# EAGLE design LED_DRIVER (EAGLE 9.6.2)
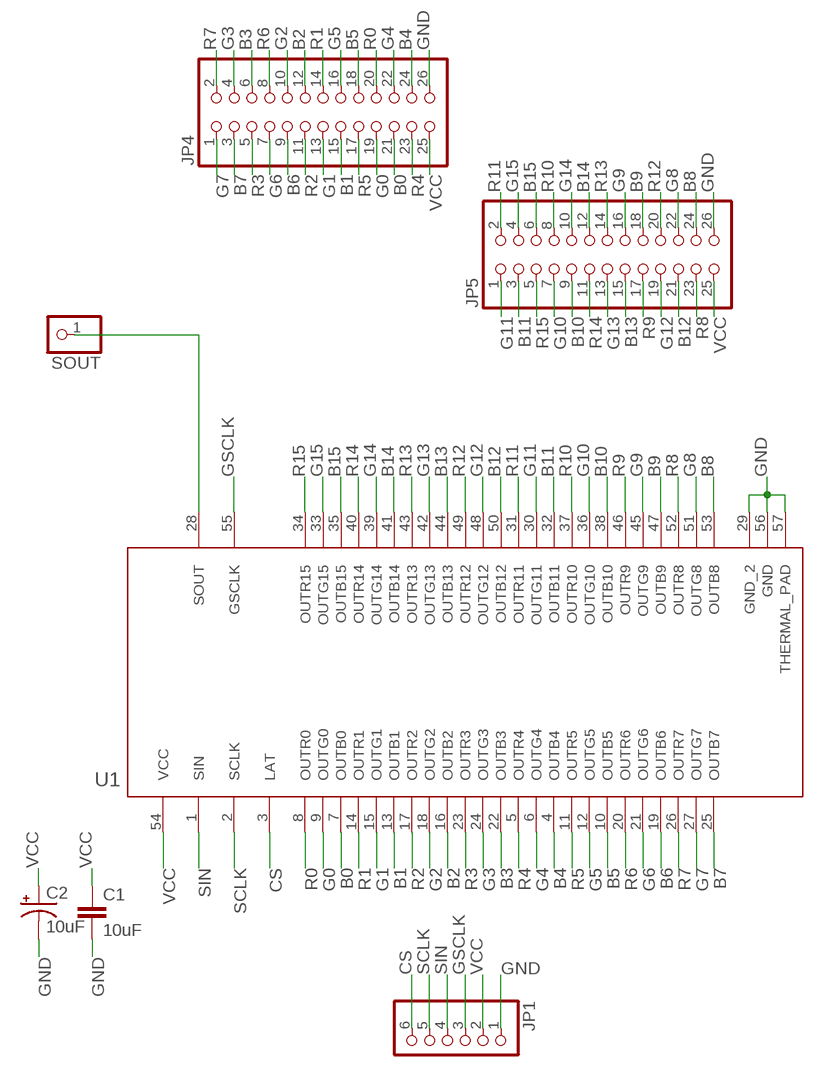
[diagram p0: schematic, sheet 1]

## Parts
C1  10uF  C-EUC0603  [C0603]
C2  10uF  CPOL-USE2-4  [E2-4]
JP1  PINHD-1X6  [1X06]
JP4  PINHD-2X13  [2X13]
JP5  PINHD-2X13  [2X13]
SOUT  PINHD-1X1  [1X01]
U1  Value  TLC6C5748QDCARQ1DCA0056F-IPC_B  [DCA0056F-IPC_B]

## Nets
B0: JP4.21 U1.7(OUTB0)
B1: JP4.15 U1.13(OUTB1)
B2: JP4.12 U1.16(OUTB2)
B3: JP4.6 U1.22(OUTB3)
B4: JP4.24 U1.4(OUTB4)
B5: JP4.18 U1.10(OUTB5)
B6: JP4.9 U1.19(OUTB6)
B7: JP4.3 U1.25(OUTB7)
B8: JP5.24 U1.53(OUTB8)
B9: JP5.18 U1.47(OUTB9)
B10: JP5.9 U1.38(OUTB10)
B11: JP5.3 U1.32(OUTB11)
B12: JP5.21 U1.50(OUTB12)
B13: JP5.15 U1.44(OUTB13)
B14: JP5.12 U1.41(OUTB14)
B15: JP5.6 U1.35(OUTB15)
CS: JP1.6 U1.3(LAT)
G0: JP4.19 U1.9(OUTG0)
G1: JP4.13 U1.15(OUTG1)
G2: JP4.10 U1.18(OUTG2)
G3: JP4.4 U1.24(OUTG3)
G4: JP4.22 U1.6(OUTG4)
G5: JP4.16 U1.12(OUTG5)
G6: JP4.7 U1.21(OUTG6)
G7: JP4.1 U1.27(OUTG7)
G8: JP5.22 U1.51(OUTG8)
G9: JP5.16 U1.45(OUTG9)
G10: JP5.7 U1.36(OUTG10)
G11: JP5.1 U1.30(OUTG11)
G12: JP5.19 U1.48(OUTG12)
G13: JP5.13 U1.42(OUTG13)
G14: JP5.10 U1.39(OUTG14)
G15: JP5.4 U1.33(OUTG15)
GND: C1.2 C2.- JP1.1 JP4.26 JP5.26 U1.29(GND_2) U1.56(GND) U1.57(THERMAL_PAD)
GSCLK: JP1.3 U1.55(GSCLK)
R0: JP4.20 U1.8(OUTR0)
R1: JP4.14 U1.14(OUTR1)
R2: JP4.11 U1.17(OUTR2)
R3: JP4.5 U1.23(OUTR3)
R4: JP4.23 U1.5(OUTR4)
R5: JP4.17 U1.11(OUTR5)
R6: JP4.8 U1.20(OUTR6)
R7: JP4.2 U1.26(OUTR7)
R8: JP5.23 U1.52(OUTR8)
R9: JP5.17 U1.46(OUTR9)
R10: JP5.8 U1.37(OUTR10)
R11: JP5.2 U1.31(OUTR11)
R12: JP5.20 U1.49(OUTR12)
R13: JP5.14 U1.43(OUTR13)
R14: JP5.11 U1.40(OUTR14)
R15: JP5.5 U1.34(OUTR15)
SCLK: JP1.5 U1.2(SCLK)
SIN: JP1.4 U1.1(SIN)
SOUT: SOUT.1 U1.28(SOUT)
VCC: C1.1 C2.+ JP1.2 JP4.25 JP5.25 U1.54(VCC)

## Library data of the parts
C1 = rcl:C-EU: CAPACITOR, European symbol; SPICEPREFIX: C
C2 = rcl:CPOL-US: POLARIZED CAPACITOR, American symbol; SPICEPREFIX: C
JP1 = pinhead:PINHD-1X6: PIN HEADER
JP4 JP5 = pinhead:PINHD-2X13: PIN HEADER
SOUT = adafruit:PINHD-1X1: Pin header 1x1 for 0.1" spacing With round pins
U1 = 48chLEDDriver:TLC6C5748QDCARQ1; MANUFACTURER: Texas Instruments; PARTNUMBER: TLC6C5748QDCARQ1; REFDES: RefDes; TYPE: TYPE

## Board
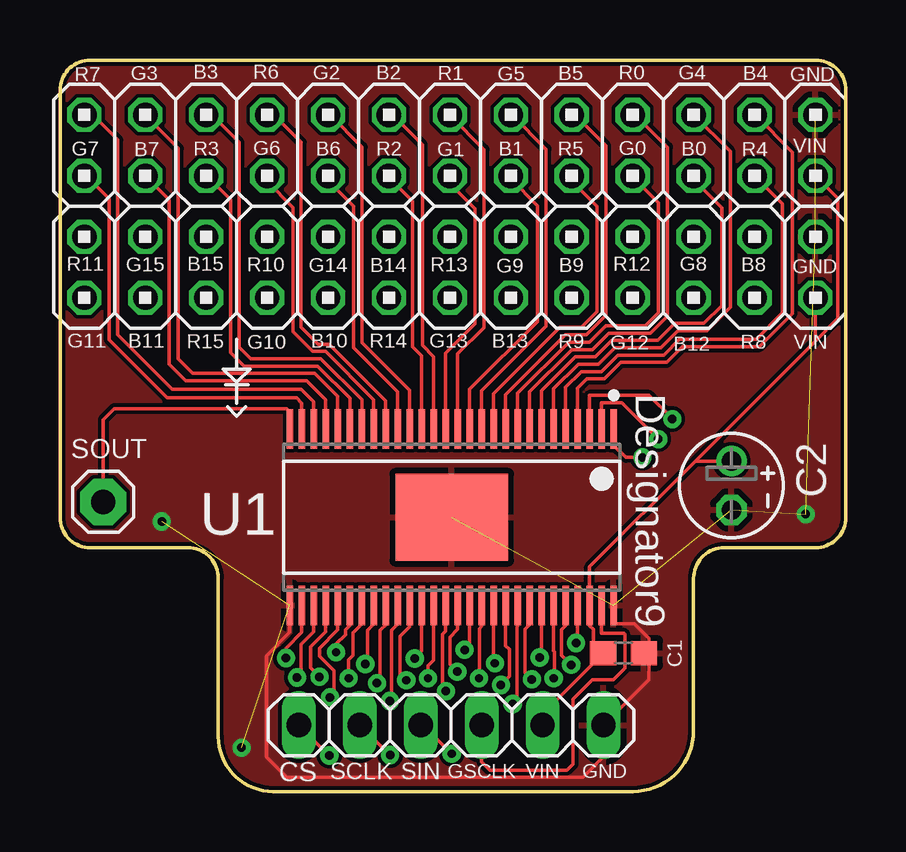
[diagram p1: board, top side]
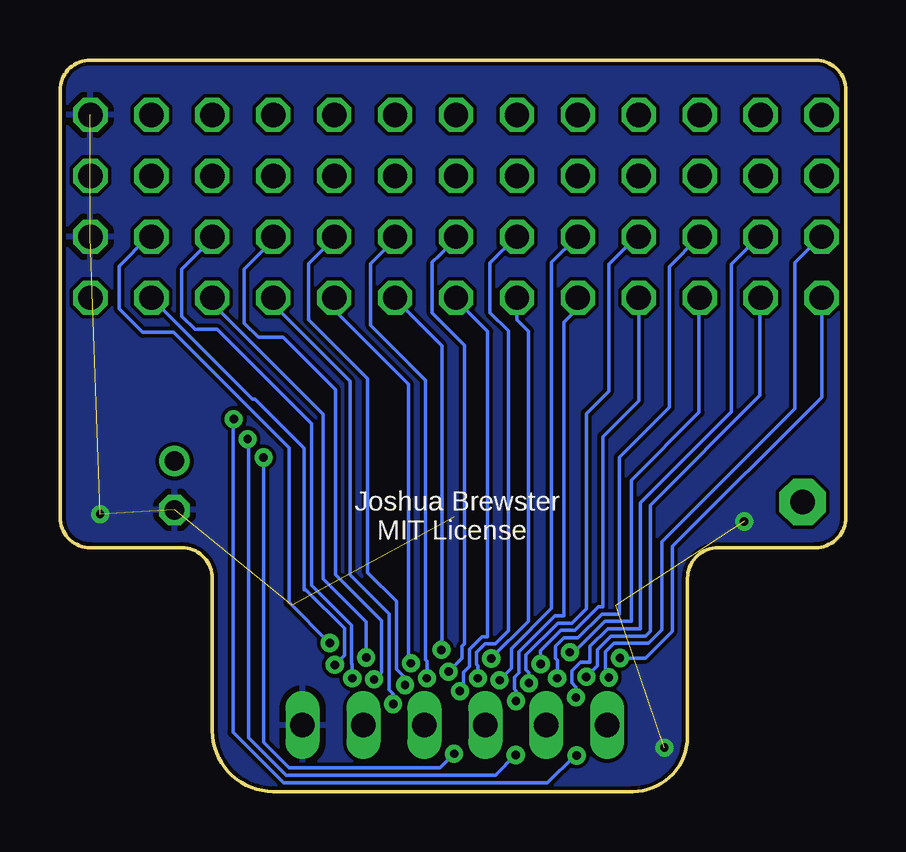
[diagram p2: board, bottom side, seen from below]

Size 32.77 x 30.48 mm. Coordinates in mm from the lower left corner, seen from the top.
Outline: 0,11.43 0,29.21 arc-90 1.27,30.48 31.5,30.48 arc-90 32.77,29.21 32.77,11.43 arc-90 31.5,10.16 27.69,10.16 arc90 26.42,8.89 26.42,2.54 arc-90 23.88,0 8.89,0 arc-90 6.6,2.29 6.6,8.89 arc90 5.33,10.16 1.27,10.16 arc-90 0,11.43
Copper layers (1*16): Top 0.035mm / dielectric 1.5mm / Bottom 0.035mm
Design rules "default *": minimum track width 6mil, minimum drill 0.35mm, track to track 6mil, track to pad 6mil, pad to pad 6mil, via to via 6mil, smd to smd 6mil, copper to edge 6mil, drill to drill 6mil, minimum pad ring 8mil, minimum via ring 8mil, stop-mask expansion 4mil, vias tented up to drill 0mil, thermal gap 10mil

### Footprints (pad centres in the part's own frame; a part is rotated, then mirrored left to right if it is on the bottom)
C0603 = smd 1.1 x 1: 1 -0.85,0; 2 0.85,0
E2-4 = drill 0.813 pad 1.27: + -1.016,0 | drill 0.813 pad 1.27 octagon: - 1.016,0
1X06 = drill 1.016 long: 1 -6.35,0; 2 -3.81,0; 3 -1.27,0; 4 1.27,0; 5 3.81,0; 6 6.35,0
2X13 = drill 1.016 octagon: 1 -15.24,-1.27; 2 -15.24,1.27; 3 -12.7,-1.27; 4 -12.7,1.27; 5 -10.16,-1.27; 6 -10.16,1.27; 7 -7.62,-1.27; 8 -7.62,1.27; 9 -5.08,-1.27; 10 -5.08,1.27; 11 -2.54,-1.27; 12 -2.54,1.27; 13 0,-1.27; 14 0,1.27; 15 2.54,-1.27; 16 2.54,1.27; 17 5.08,-1.27; 18 5.08,1.27; 19 7.62,-1.27; 20 7.62,1.27; 21 10.16,-1.27; 22 10.16,1.27; 23 12.7,-1.27; 24 12.7,1.27; 25 15.24,-1.27; 26 15.24,1.27
1X01 = drill 1.016 pad 1.93 octagon: 1 0,0
DCA0056F-IPC_B = smd 1.655 x 0.252: 1 -3.675,6.75; 2 -3.675,6.25; 3 -3.675,5.75; 4 -3.675,5.25; 5 -3.675,4.75; 6 -3.675,4.25; 7 -3.675,3.75; 8 -3.675,3.25; 9 -3.675,2.75; 10 -3.675,2.25; 11 -3.675,1.75; 12 -3.675,1.25; 13 -3.675,0.75; 14 -3.675,0.25; 15 -3.675,-0.25; 16 -3.675,-0.75; 17 -3.675,-1.25; 18 -3.675,-1.75; 19 -3.675,-2.25; 20 -3.675,-2.75; 21 -3.675,-3.25; 22 -3.675,-3.75; 23 -3.675,-4.25; 24 -3.675,-4.75; 25 -3.675,-5.25; 26 -3.675,-5.75; 27 -3.675,-6.25; 28 -3.675,-6.75; 29 3.675,-6.75; 30 3.675,-6.25; 31 3.675,-5.75; 32 3.675,-5.25; 33 3.675,-4.75; 34 3.675,-4.25; 35 3.675,-3.75; 36 3.675,-3.25; 37 3.675,-2.75; 38 3.675,-2.25; 39 3.675,-1.75; 40 3.675,-1.25; 41 3.675,-0.75; 42 3.675,-0.25; 43 3.675,0.25; 44 3.675,0.75; 45 3.675,1.25; 46 3.675,1.75; 47 3.675,2.25; 48 3.675,2.75; 49 3.675,3.25; 50 3.675,3.75; 51 3.675,4.25; 52 3.675,4.75; 53 3.675,5.25; 54 3.675,5.75; 55 3.675,6.25; 56 3.675,6.75 | smd 3.61 x 4.7: 57 0,0

### Placement (x,y rotation side)
C1  23.5,5.77 0 top
C2  27.99,12.75 270 top
JP1  16.31,2.77 180 top
JP4  16.26,26.92 0 top
JP5  16.26,21.84 0 top
SOUT  1.8,12.06 0 top
U1  16.33,11.43 270 top

### Tracks (layer width: path | path; a pad name or v marks a point on that pad's centre or on a via)
B0
  Top 0.152: U1.7 20.08,16.7 21.49,18.11 22.32,18.11 23.01,18.8 24.92,18.8 25.63,19.51 26.85,19.51 27.58,20.24 27.58,24.33 26.42,25.5 JP4.21
B1
  Top 0.152: U1.13 17.08,16.75 19.91,19.58 19.91,24.41 18.8,25.53 JP4.15
B2
  Top 0.152: U1.16 15.58,18.12 15.11,18.59 15.11,26.95 13.87,28.19 JP4.12
B3
  Top 0.152: U1.22 12.59,16.31 10.87,18.03 7.95,18.03 7.47,18.52 7.47,27.05 6.32,28.19 JP4.6
B4
  Top 0.152: U1.4 21.58,16.81 21.97,17.2 22.7,17.2 23.39,17.88 25.3,17.88 25.96,18.54 29.16,18.54 30.53,19.91 30.53,26.64 28.98,28.19 JP4.24
B5
  Top 0.152: U1.10 18.58,16.52 21.08,19.02 21.95,19.02 22.76,19.84 22.76,26.9 21.46,28.19 JP4.18
B6
  Top 0.152: U1.19 14.08,16.65 12.24,18.49 12.24,24.38 11.18,25.45 JP4.9
B7
  Top 0.152: U1.25 11.08,16.32 10.29,17.12 5.23,17.12 4.55,17.8 4.55,24.66 JP4.3
B8  (via drill 0.35 pad 0.55)
  Top 0.152: U1.53 21.58,6.25 v21.52,6.19
  Bottom 0.152: v21.52,6.19 23.22,7.88 23.22,14.32 28.02,19.13 29.31,19.13 30.3,20.12 30.3,21.89 29.08,23.11 JP5.24
B9  (via drill 0.35 pad 0.55)
  Top 0.152: U1.47 18.58,6.08 18.74,5.93 18.74,4.8 v18.38,4.44
  Bottom 0.152: v18.38,4.44 18.38,4.73 18.74,5.09 18.74,7.92 19.94,9.12 19.94,17.2 22.4,19.66 22.4,22 21.34,23.06 JP5.18
B10  (via drill 0.35 pad 0.55)
  Top 0.152: U1.38 14.08,6.97 13.83,6.72 13.83,3.85 v13.75,3.77
  Bottom 0.152: v13.75,3.77 13.75,4.2 13.82,4.27 13.82,4.77 13.64,4.95 13.64,5.82 12.14,7.32 11.76,7.32 11.76,19.56 11.18,20.14 JP5.9
B11  (via drill 0.35 pad 0.55)
  Top 0.152: U1.32 11.08,6.66 10.45,6.03 10.45,5.15 v10.82,4.78
  Bottom 0.152: v10.82,4.78 10.36,5.23 10.36,5.92 9.8,6.48 8.36,6.48 8.15,6.68 8.15,11.94 3.58,16.51 3.58,20.55 JP5.3
B12  (via drill 0.35 pad 0.55)
  Top 0.152: U1.50 20.08,5.67 v20,5.58
  Bottom 0.152: v20,5.58 20,7.07 21.79,8.87 21.79,15.72 26.42,20.34 JP5.21
B13  (via drill 0.35 pad 0.55)
  Top 0.152: v16.87,5.91 17.07,6.11 17.07,6.82 17.08,6.83 U1.44
  Bottom 0.152: v16.87,5.91 16.84,5.91 16.84,18.57 18.8,20.52 JP5.15
B14  (via drill 0.35 pad 0.55)
  Top 0.152: U1.41 15.58,5.48 15.35,5.24 v15.35,4.72
  Bottom 0.152: v15.35,4.72 15.35,5.24 15.4,5.29 15.4,5.8 15.04,6.15 14.61,6.15 14.07,6.69 14.07,19.19 14.83,19.96 14.83,22.02 13.74,23.11 JP5.12
B15  (via drill 0.35 pad 0.55)
  Top 0.152: U1.35 12.58,6.97 12.23,6.61 12.23,5.67 12.04,5.48 v12.04,4.72
  Bottom 0.152: v12.04,4.72 12.04,5.47 12.12,5.55 12.12,6.05 11.76,6.41 11.17,6.41 10.18,7.39 9.45,7.39 9.45,13.92 7.37,16 7.37,21.87 6.12,23.11 JP5.6
CS  (via drill 0.35)
  Top 0.152: v11.23,1.5 JP1.6 | v25.52,15.52 25.52,15.54 24.56,16.51 22.07,16.51 22.07,15.11 U1.3
  Bottom 0.152: v11.23,1.5 11.3,1.5 12.45,0.36 23.44,0.36 25.55,2.46 25.55,15.51 25.55,15.52 v25.52,15.52
G0
  Top 0.152: U1.9 19.08,16.59 21.21,18.72 22.07,18.72 22.76,19.41 24.41,19.41 24.94,19.94 24.94,24.54 23.88,25.6 JP4.19
G1
  Top 0.152: U1.15 16.08,18.27 17.3,19.48 17.3,24.28 16.26,25.32 JP4.13
G2
  Top 0.152: U1.18 14.58,16.71 12.6,18.69 12.6,26.85 11.25,28.19 JP4.10
G3
  Top 0.152: U1.24 11.58,16.46 10.62,17.42 5.54,17.42 4.93,18.03 4.93,26.8 3.56,28.17 JP4.4
G4
  Top 0.152: U1.6 20.58,16.77 21.62,17.8 22.45,17.8 23.14,18.49 25.04,18.49 25.75,19.2 26.97,19.2 27.94,20.17 27.94,26.67 JP4.22
G5
  Top 0.152: U1.12 17.58,16.69 20.27,19.38 20.27,26.77 18.85,28.19 JP4.16
G6
  Top 0.152: U1.21 13.08,16.33 11.07,18.34 10.54,18.34 9.73,19.15 9.73,24.33 8.64,25.43 JP4.7
G7
  Top 0.152: U1.27 10.08,16.18 9.86,16.41 4.47,16.41 2.06,18.82 2.06,24.69 1.09,25.65 JP4.1
G8  (via drill 0.35 pad 0.55)
  Top 0.152: U1.51 20.58,5.86 20.61,5.83 20.61,4.75 v20.58,4.72
  Bottom 0.152: v20.58,4.72 20.58,5.31 20.61,5.33 20.61,6.93 22.28,8.6 22.28,15.32 26.21,19.25 27.13,19.25 27.69,19.81 27.69,21.77 26.42,23.04 JP5.22
G9  (via drill 0.35 pad 0.55)
  Top 0.152: U1.45 17.58,6.89 17.48,6.79 17.48,4.73 v17.47,4.72
  Bottom 0.152: v17.47,4.72 17.47,5.43 17.53,5.49 17.53,17.14 19.81,19.43 19.81,22 18.8,23.01 JP5.16
G10  (via drill 0.35 pad 0.55)
  Top 0.152: U1.36 13.08,6.97 12.83,6.71 12.83,5.32 v12.73,5.32
  Bottom 0.152: v12.73,5.32 12.73,5.87 11.89,6.71 11.29,6.71 10.31,7.7 10.13,7.7 10.13,14.78 8.64,16.28 JP5.7
G11  (via drill 0.35 pad 0.55)
  Top 0.152: U1.30 10.08,6.64 9.42,5.98 v9.42,5.56
  Bottom 0.152: v9.42,5.56 8.36,5.56 7.24,6.68 7.24,10.21 1.02,16.43 JP5.1
G12  (via drill 0.35 pad 0.55)
  Top 0.152: U1.48 19.08,6.89 19.04,6.85 19.04,3.82 v18.88,3.65
  Bottom 0.152: v18.88,3.65 18.88,4.07 19.04,4.24 19.04,7.41 20.68,9.04 20.68,17.09 23.88,20.3 JP5.19
G13  (via drill 0.35 pad 0.55)
  Top 0.152: U1.42 16.08,6.69 15.96,6.56 15.96,4.32 v16.09,4.18
  Bottom 0.152: v16.09,4.18 15.95,4.32 15.95,4.97 15.7,5.22 15.7,5.92 15.17,6.46 14.93,6.46 14.93,19.18 16.26,20.5 JP5.13
G14  (via drill 0.35 pad 0.55)
  Top 0.152: U1.39 14.58,6.86 14.18,6.46 14.18,4.89 v14.44,4.64
  Bottom 0.152: v14.44,4.64 13.94,5.13 13.94,5.95 12.27,7.63 12.27,22.05 11.2,23.11 JP5.10
G15  (via drill 0.35 pad 0.55)
  Top 0.152: v11.25,3.92 11.43,4.1 11.43,4.83 11.43,5.03 10.82,5.63 10.82,5.97 11.58,6.73 U1.33
  Bottom 0.152: v11.25,3.92 11.25,4.35 11.43,4.52 11.43,5.03 11.07,5.38 10.67,5.38 10.67,6.04 9.93,6.78 8.56,6.78 8.56,12.04 4.77,15.82 4.77,21.97 3.63,23.11 JP5.4
GND  (via drill 0.35)  (7 unrouted)
  Top 0.152: U1.56 23.08,6.99 23.95,6.99 24.55,6.39 24.55,5.74 | 24.55,5.74 24.55,4.67 JP1.1 22.66,1.45 21.79,0.58 9.45,0.58 8.61,1.42 8.61,5.66 9.58,6.64 U1.29 | C1.2 24.53,5.77 24.55,5.74
  other vias: 7.57,1.83 4.24,11.25 31.09,11.56
  pour Top: -0.28,6.17 -0.28,30.48 0.36,31.11 32.44,31.11 33.6,29.95 33.6,6.93 24.87,-1.37 7.26,-1.37
  pour Bottom: -0.33,30.18 -0.33,30.43 0.38,31.14 32.44,31.14 33.63,29.95 33.63,6.99 26.11,-0.53 7.16,-0.53 1.45,5.18 -0.33,6.96
GSCLK
  Top 0.152: U1.55 22.58,6.59 23.51,6.59 23.55,6.55 23.55,5.13 23.06,4.65 22.2,4.65 21.39,3.83 21.39,1.14 21.13,0.89 17.93,0.89 17.58,1.25 JP1.3
R0
  Top 0.152: U1.8 19.58,16.66 21.34,18.41 22.2,18.41 22.88,19.1 24.61,19.1 25.32,19.81 25.32,26.85 23.98,28.19 JP4.20
R1
  Top 0.152: U1.14 16.58,18.23 17.68,19.33 17.68,26.75 16.26,28.17 JP4.14
R2
  Top 0.152: U1.17 15.08,18.17 14.71,18.54 14.71,24.59 13.72,25.58 JP4.11
R3
  Top 0.152: U1.23 12.09,16.38 10.74,17.73 7.67,17.73 7.11,18.29 7.11,24.66 6.12,25.65 JP4.5
R4
  Top 0.152: U1.5 21.08,16.84 21.74,17.5 22.58,17.5 23.26,18.19 25.17,18.19 25.83,18.85 29.03,18.85 30.12,19.94 30.12,24.49 JP4.23
R5
  Top 0.152: U1.11 18.08,16.58 20.85,19.36 21.74,19.36 22.38,19.99 22.38,24.38 21.34,25.43 JP4.17
R6
  Top 0.152: U1.20 13.58,16.29 11.23,18.64 10.77,18.64 10.06,19.36 10.06,27.05 8.91,28.19 JP4.8
R7
  Top 0.152: U1.26 10.58,16.24 10.06,16.76 4.67,16.76 2.41,19.02 2.41,27.15 1.37,28.19 JP4.2
R8  (via drill 0.35 pad 0.55)
  Top 0.152: U1.52 21.08,6.91 20.91,6.74 20.91,5.68 v21.31,5.28
  Bottom 0.152: v21.31,5.28 20.91,5.68 20.91,6.8 22.52,8.41 22.58,8.41 22.58,14.29 24.64,16.35 24.73,16.35 JP5.23
R9  (via drill 0.35 pad 0.55)
  Top 0.152: U1.46 18.08,5.39 v18.13,5.34
  Bottom 0.152: v18.13,5.34 18.24,5.45 18.24,16.97 21.34,20.07 JP5.17
R10  (via drill 0.35 pad 0.55)
  Top 0.152: U1.37 13.61,7.73 13.61,6.97 13.35,6.71 13.35,4.66 v13.21,4.52
  Bottom 0.152: v13.21,4.52 13.21,4.95 13.33,5.07 13.33,5.7 12.01,7.02 11.42,7.02 10.82,7.62 10.82,15.75 9.88,16.69 9.88,21.97 8.74,23.11 JP5.8
R11  (via drill 0.35 pad 0.55)
  Top 0.152: U1.31 10.58,6.66 10.05,6.13 10.05,4.92 v9.88,4.75
  Bottom 0.152: v9.88,4.75 10.03,4.9 10.03,5.82 9.68,6.17 8.23,6.17 7.67,6.73 7.67,10.41 2.13,15.95 2.13,22.02 1.04,23.11 JP5.2
R12  (via drill 0.35 pad 0.55)
  Top 0.152: U1.49 19.58,6.94 19.39,6.75 19.39,4.95 v19.67,4.67
  Bottom 0.152: v19.67,4.67 19.37,4.98 19.37,7.12 21.29,9.04 21.29,16.74 23.47,18.92 24.49,18.92 25.08,19.52 25.08,21.75 23.88,22.96 JP5.20
R13  (via drill 0.35 pad 0.55)
  Top 0.152: U1.43 16.58,6.76 16.26,6.43 16.26,5.3 v16.56,5
  Bottom 0.152: v16.56,5 16.01,5.55 16.01,6.05 15.9,6.15 15.9,18.59 17.25,19.94 17.25,22.05 16.94,22.35 16.89,22.4 16.26,23.04 JP5.14
R14  (via drill 0.35 pad 0.55)
  Top 0.152: v14.79,5.54 15.08,5.84 U1.40
  Bottom 0.152: v14.79,5.54 13.23,7.1 13.23,19.18 13.72,19.66 JP5.11
R15  (via drill 0.35 pad 0.55)
  Top 0.152: U1.34 12.08,6.92 11.9,6.74 11.9,6.54 11.5,6.13 11.5,5.81 v11.51,5.8
  Bottom 0.152: v11.51,5.8 11.34,5.8 10.06,7.09 8.94,7.09 8.94,12.98 6.12,15.8 6.12,20.55 JP5.5
SCLK  (via drill 0.35)
  Top 0.152: v13.77,1.52 13.74,1.52 JP1.5 | v24.94,14.68 23.42,16.2 22.58,16.2 U1.2
  Bottom 0.152: v13.77,1.52 14.62,0.67 23.33,0.67 24.89,2.23 24.89,14.63 v24.94,14.68
SIN  (via drill 0.35)
  Top 0.152: v16.33,1.57 15.14,2.77 JP1.4 | v24.28,13.92 23.6,13.92 23.08,14.43 U1.1
  Bottom 0.152: v16.33,1.57 16.92,0.99 23.22,0.99 24.28,2.06 v24.28,13.92
SOUT
  Top 0.152: U1.28 9.58,15.82 9.45,15.95 2.26,15.95 1.8,15.49 SOUT.1
VCC
  Top 0.152: JP1.2 20.12,3.23 22.23,5.34 22.23,5.87 | 22.23,5.87 22.23,6.76 22.08,6.92 U1.54 22.08,9.36 26.49,13.77 | C1.1 22.34,5.77 22.23,5.87 | C2.+ 26.49,13.77 | 26.49,13.77 31.5,18.77 | 31.5,18.77 JP5.25 | 31.5,18.77 32.44,19.71 32.44,24.71 JP4.25

### Text on the board
tPlace: R7 | G3 | B3 | R6 | G2 | B2 | R1 | G5 | B5 | R0 | G4 | B4 | GND | G6 | G0 | VIN | G7 | B7 | R3 | B6 | R2 | G1 | B1 | R5 | B0 | R4 | R11 | G15 | B15 | R10 | G14 | B14 | R13 | G9 | B9 | R12 | G8 | B8 | GND | G11 | B11 | R15 | G10 | B10 | R14 | G13 | B13 | R9 | G12 | B12 | R8 | VIN | U1 | SCLK | SIN | GSCLK | VIN | GND | CS
bPlace: Joshua Brewster / MIT License